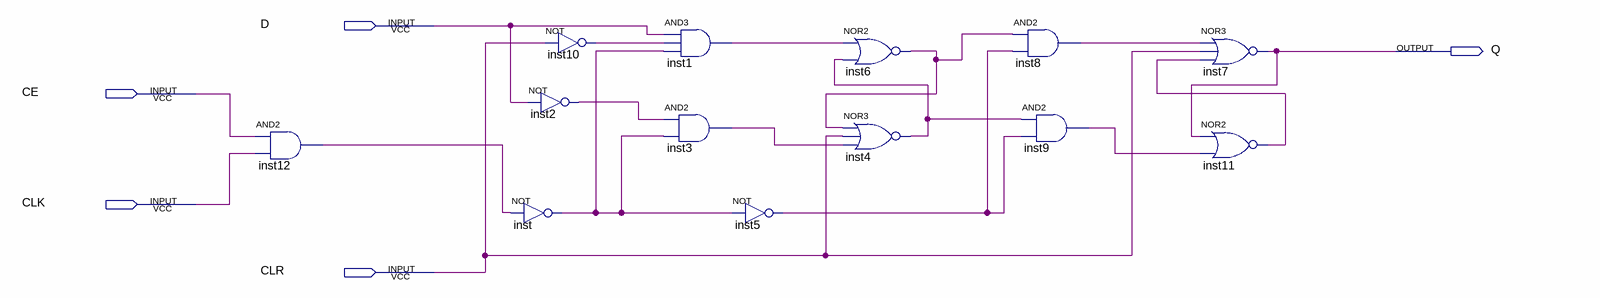
[diagram p0: schematic sheet]
// Quartus schematic FDCE.bdf as structural Verilog: 13 symbols, 5 pins
module FDCE (
  input  D,
  input  CE,
  input  CLK,
  input  CLR,
  output Q
);

  wire inst1_out, inst2_out, inst3_out, inst4_out, inst5_out, inst6_out, inst8_out, inst9_out, inst10_out,
       inst11_out, inst12_out, inst_out;

  and inst12 (inst12_out, CE, CLK);
  not inst2 (inst2_out, D);
  not inst (inst_out, inst12_out);
  not inst10 (inst10_out, CLR);
  and inst1 (inst1_out, D, inst10_out, inst_out);
  and inst3 (inst3_out, inst2_out, inst_out);
  not inst5 (inst5_out, inst_out);
  nor inst6 (inst6_out, inst1_out, inst4_out);
  nor inst4 (inst4_out, inst6_out, CLR, inst3_out);
  and inst8 (inst8_out, inst6_out, inst5_out);
  and inst9 (inst9_out, inst4_out, inst5_out);
  nor inst7 (Q, inst8_out, CLR, inst11_out);
  nor inst11 (inst11_out, Q, inst9_out);
endmodule
